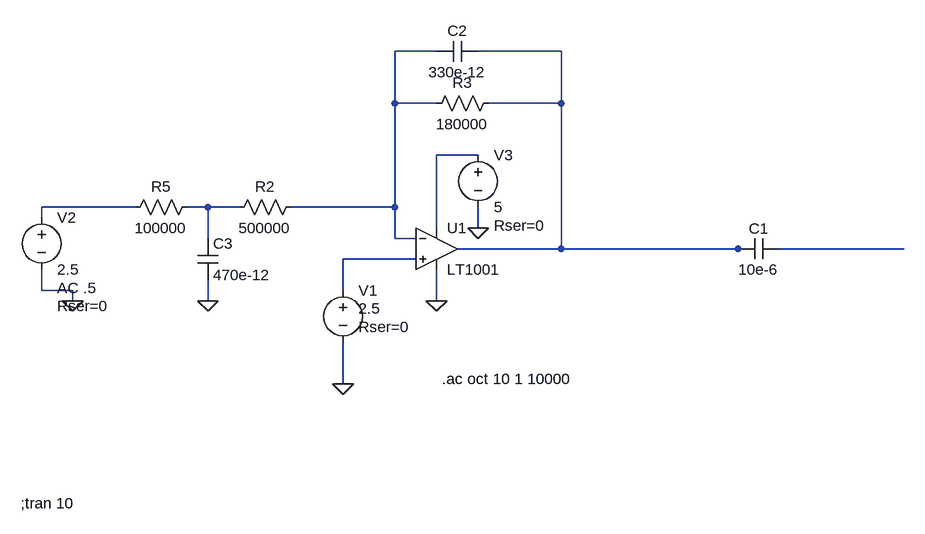
[diagram p0: schematic opamp output.asc]
opamp output.asc, the LTspice schematic file:
Version 4
SHEET 1 1076 680
WIRE 352 -192 288 -192
WIRE 544 -192 416 -192
WIRE 288 -112 288 -192
WIRE 352 -112 288 -112
WIRE 544 -112 544 -192
WIRE 544 -112 432 -112
WIRE 416 -32 352 -32
WIRE -112 48 -256 48
WIRE 0 48 -32 48
WIRE 48 48 0 48
WIRE 288 48 288 -112
WIRE 288 48 128 48
WIRE -256 64 -256 48
WIRE 352 80 352 -32
WIRE 416 80 416 48
WIRE 0 96 0 48
WIRE 288 96 288 48
WIRE 320 96 288 96
WIRE 544 112 544 -112
WIRE 544 112 384 112
WIRE 816 112 544 112
WIRE 832 112 816 112
WIRE 1072 112 880 112
WIRE 320 128 208 128
WIRE -256 176 -256 144
WIRE -208 176 -256 176
WIRE 208 176 208 128
WIRE -208 192 -208 176
WIRE 0 192 0 160
WIRE 352 192 352 144
WIRE 208 320 208 256
FLAG -208 192 0
FLAG 352 192 0
FLAG 416 80 0
FLAG 208 320 0
FLAG 0 192 0
SYMBOL cap 880 96 R90
WINDOW 0 0 32 VBottom 2
WINDOW 3 32 32 VTop 2
SYMATTR InstName C1
SYMATTR Value 10e-6
SYMBOL Opamps\\LT1001 352 48 R0
SYMATTR InstName U1
SYMBOL voltage 208 160 R0
WINDOW 3 24 44 Left 2
WINDOW 123 0 0 Left 2
WINDOW 39 24 72 Left 2
SYMATTR Value 2.5
SYMATTR SpiceLine Rser=0
SYMATTR InstName V1
SYMBOL voltage -256 48 R0
WINDOW 123 24 124 Left 2
WINDOW 39 24 152 Left 2
SYMATTR Value2 AC .5
SYMATTR SpiceLine Rser=0
SYMATTR InstName V2
SYMATTR Value 2.5
SYMBOL res 448 -128 R90
WINDOW 0 0 56 VBottom 2
WINDOW 3 32 56 VTop 2
SYMATTR InstName R3
SYMATTR Value 180000
SYMBOL cap 416 -208 R90
WINDOW 0 0 32 VBottom 2
WINDOW 3 32 32 VTop 2
SYMATTR InstName C2
SYMATTR Value 330e-12
SYMBOL voltage 416 -48 R0
WINDOW 123 0 0 Left 2
WINDOW 39 24 124 Left 2
SYMATTR SpiceLine Rser=0
SYMATTR InstName V3
SYMATTR Value 5
SYMBOL res 144 32 R90
WINDOW 0 0 56 VBottom 2
WINDOW 3 32 56 VTop 2
SYMATTR InstName R2
SYMATTR Value 500000
SYMBOL res -16 32 R90
WINDOW 0 0 56 VBottom 2
WINDOW 3 32 56 VTop 2
SYMATTR InstName R5
SYMATTR Value 100000
SYMBOL cap -16 96 R0
SYMATTR InstName C3
SYMATTR Value 470e-12
TEXT -288 504 Left 2 !;tran 10
TEXT 360 312 Left 2 !.ac oct 10 1 10000

The netlist it stands for:
* opamp output.asc
C1 N006 N002 10e-6
XU1 N007 N001 N003 0 N002 LT1001  ; pins In+ In- V+ V- OUT
V1 N007 0 2.5 Rser=0
V2 N004 0 2.5 AC .5 Rser=0
R3 N002 N001 180000
C2 N002 N001 330e-12
V3 N003 0 5 Rser=0
R2 N001 N005 500000
R5 N005 N004 100000
C3 N005 0 470e-12
;tran 10
.ac oct 10 1 10000
.lib LTC.lib
.backanno
.end